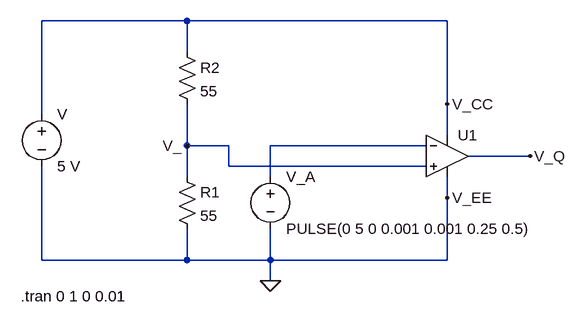
[diagram p0: schematic assig2_q2.asc]
assig2_q2.asc, the LTspice schematic file:
Version 4
SHEET 1 880 680
WIRE -128 -64 -352 -64
WIRE 272 -64 -128 -64
WIRE -128 -16 -128 -64
WIRE 272 64 272 -64
WIRE -352 80 -352 -64
WIRE 272 112 272 64
WIRE -128 128 -128 64
WIRE -64 128 -128 128
WIRE 240 128 0 128
WIRE 400 144 304 144
WIRE -64 160 -64 128
WIRE 240 160 -64 160
WIRE -128 176 -128 128
WIRE 0 176 0 128
WIRE 272 208 272 176
WIRE -352 304 -352 160
WIRE -128 304 -128 256
WIRE -128 304 -352 304
WIRE 0 304 0 256
WIRE 0 304 -128 304
WIRE 272 304 272 208
WIRE 272 304 0 304
WIRE 0 336 0 304
FLAG 0 336 0
FLAG 272 208 V_EE
FLAG 272 64 V_CC
FLAG 400 144 V_Q
FLAG -128 128 V_
SYMBOL res -144 160 R0
SYMATTR InstName R1
SYMATTR Value 55
SYMBOL res -144 -32 R0
SYMATTR InstName R2
SYMATTR Value 55
SYMBOL voltage -352 64 R0
SYMATTR InstName V
SYMATTR Value 5 V
SYMBOL OpAmps\\UniversalOpamp2 272 144 R0
SYMATTR InstName U1
SYMBOL voltage 0 160 R0
WINDOW 123 0 0 Left 0
WINDOW 39 0 0 Left 0
SYMATTR InstName V_A
SYMATTR Value PULSE(0 5 0 0.001 0.001 0.25 0.5)
TEXT -384 360 Left 2 !.tran 0 1 0 0.01

The netlist it stands for:
* assig2_q2.asc
R1 V_ 0 55
R2 V_CC V_ 55
V V_CC 0 5 V
XU1 V_ N001 V_CC 0 V_Q level.2 Avol=1Meg GBW=10Meg Slew=10Meg ilimit=25m rail=0 Vos=0 phimargin=45 en=0 enk=0 in=0 ink=0 Rin=500Meg  ; pins IN+ IN- V+ V- OUT
V_A N001 0 PULSE(0 5 0 0.001 0.001 0.25 0.5)
.tran 0 1 0 0.01
.lib UniversalOpamps2.sub
.backanno
.end